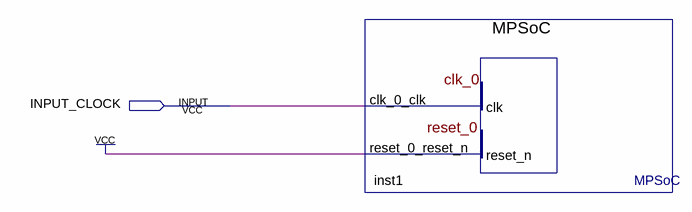
[diagram p0: schematic sheet]
// Quartus schematic TopLevel.bdf as structural Verilog: 1 symbols, 1 pins
module TopLevel (
  input  INPUT_CLOCK
);

  MPSoC inst1 (.clk_0_clk(INPUT_CLOCK), .reset_0_reset_n(1'b1));
endmodule
